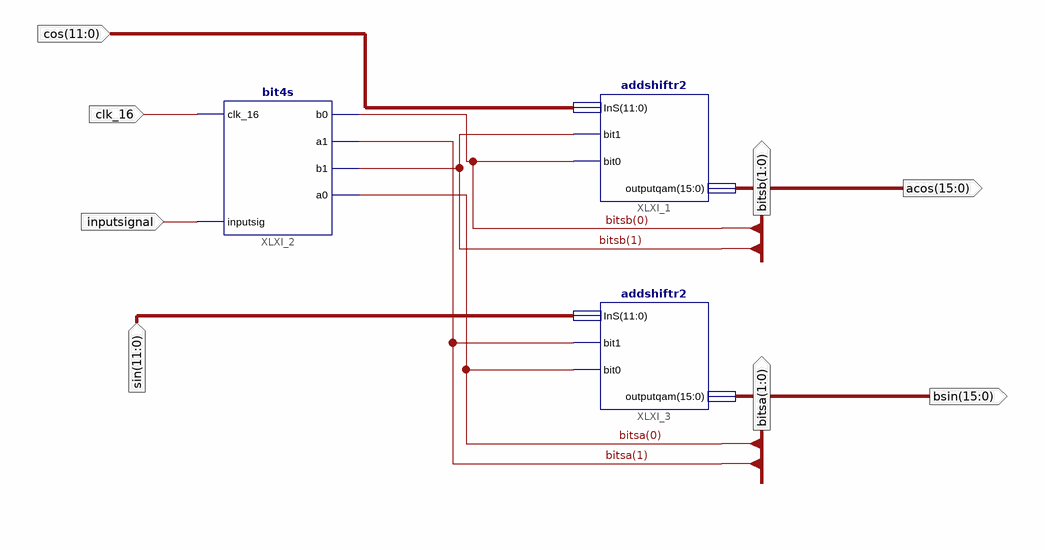
[diagram p0: schematic sheet 1]
// Xilinx ISE schematic qamtheta.sch (spartan3) as structural Verilog: 3 symbols, 8 ports
module qamtheta (
  input  clk_16,
  input  inputsignal,
  input  [11:0] cos,
  input  [11:0] sin,
  output [15:0] acos,
  output [15:0] bsin,
  output [1:0] bitsb,
  output [1:0] bitsa
);

  addshiftr2 XLXI_1 (.InS(cos), .bit1(bitsb[1]), .bit0(bitsb[0]), .outputqam(acos));
  bit4s XLXI_2 (.clk_16(clk_16), .a1(bitsa[1]), .a0(bitsa[0]), .b0(bitsb[0]), .b1(bitsb[1]), .inputsig(inputsignal));
  addshiftr2 XLXI_3 (.InS(sin), .bit1(bitsa[1]), .bit0(bitsa[0]), .outputqam(bsin));
endmodule
